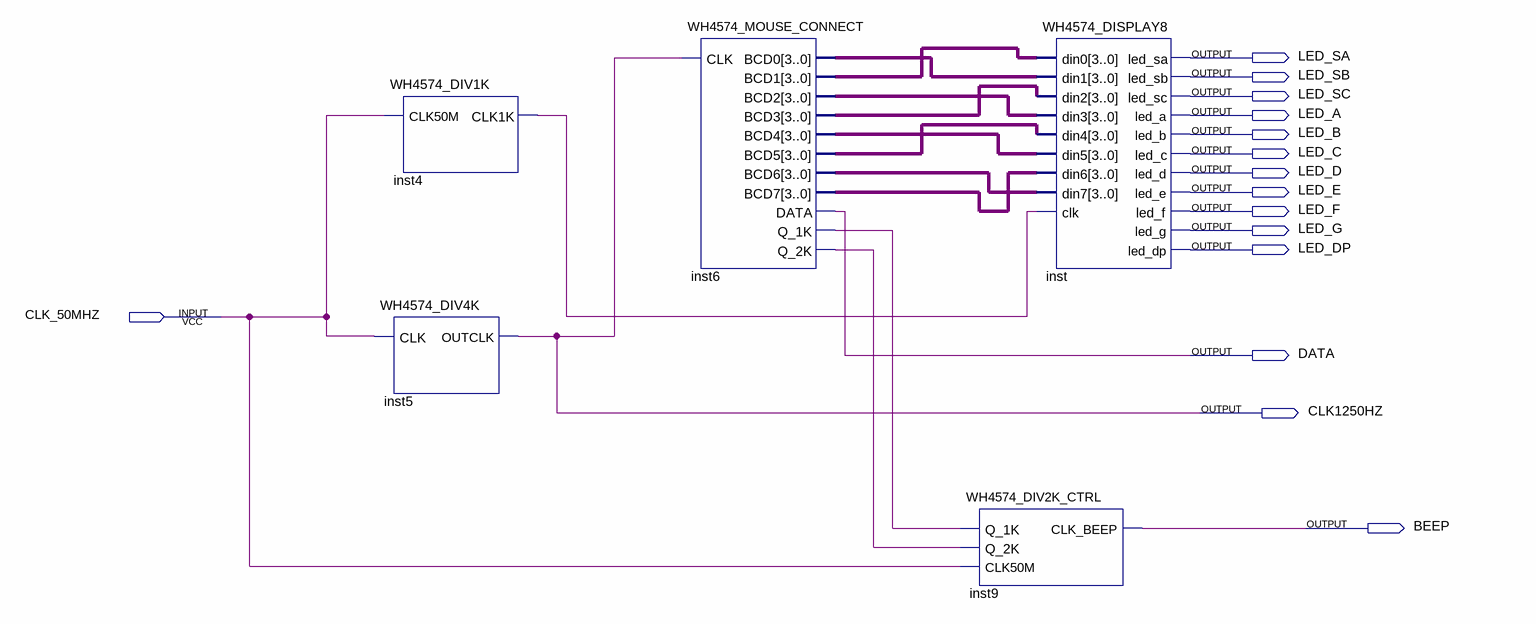
[diagram p0: schematic sheet]
// Quartus schematic WH4574_MOUSE_OVERALL.bdf as structural Verilog: 5 symbols, 15 pins
module WH4574_MOUSE_OVERALL (
  input  CLK_50MHZ,
  output LED_SA,
  output LED_SB,
  output LED_SC,
  output LED_A,
  output LED_B,
  output LED_C,
  output LED_D,
  output LED_E,
  output LED_F,
  output LED_G,
  output LED_DP,
  output DATA,
  output CLK1250HZ,
  output BEEP
);

  wire inst4_clk1k, inst6_q_1k, inst6_q_2k;
  wire [3:0] inst6_bcd0, inst6_bcd1, inst6_bcd2, inst6_bcd3, inst6_bcd4, inst6_bcd5, inst6_bcd6, inst6_bcd7;

  WH4574_DIV1K inst4 (.CLK50M(CLK_50MHZ), .CLK1K(inst4_clk1k));
  WH4574_DIV4K inst5 (.CLK(CLK_50MHZ), .OUTCLK(CLK1250HZ));
  WH4574_MOUSE_CONNECT inst6 (
    .CLK(CLK1250HZ), .BCD0(inst6_bcd0), .BCD1(inst6_bcd1), .BCD2(inst6_bcd2), .BCD3(inst6_bcd3),
    .BCD4(inst6_bcd4), .BCD5(inst6_bcd5), .BCD6(inst6_bcd6), .BCD7(inst6_bcd7), .DATA(DATA),
    .Q_1K(inst6_q_1k), .Q_2K(inst6_q_2k));
  WH4574_DIV2K_CTRL inst9 (.Q_1K(inst6_q_1k), .Q_2K(inst6_q_2k), .CLK50M(CLK_50MHZ), .CLK_BEEP(BEEP));
  WH4574_DISPLAY8 inst (
    .din0(inst6_bcd1), .din1(inst6_bcd0), .din2(inst6_bcd3), .din3(inst6_bcd2), .din4(inst6_bcd5),
    .din5(inst6_bcd4), .din6(inst6_bcd7), .din7(inst6_bcd6), .clk(inst4_clk1k), .led_sa(LED_SA),
    .led_sb(LED_SB), .led_sc(LED_SC), .led_a(LED_A), .led_b(LED_B), .led_c(LED_C), .led_d(LED_D),
    .led_e(LED_E), .led_f(LED_F), .led_g(LED_G), .led_dp(LED_DP));
endmodule
